# Altium schematic sheet Connector.SchDoc
size A4; SheetNumber: 2; SheetTotal: 2
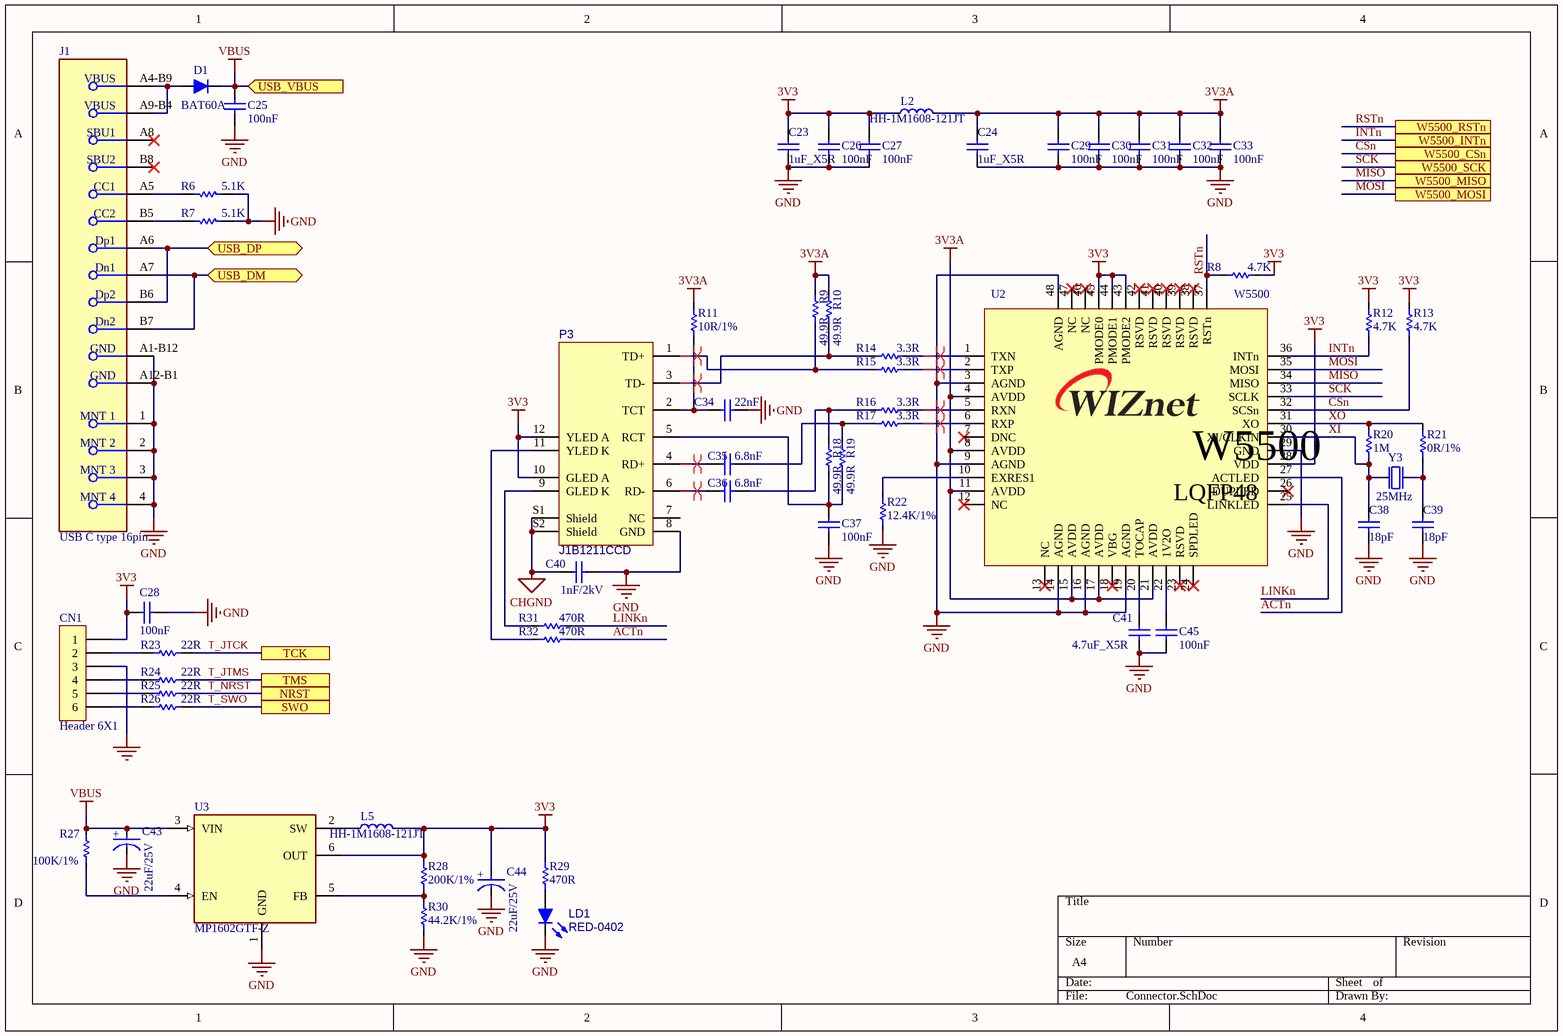
[diagram p0: Connector.SchDoc]

## Parts
C23  1uF_X5R  [CAP-0402]
C24  1uF_X5R  [CAP-0402]
C25  100nF  [0603C]
C26  100nF  [0603C]
C27  100nF  [0603C]
C28  100nF  [0603C]
C29  100nF  [0603C]
C30  100nF  [0603C]
C31  100nF  [0603C]
C32  100nF  [0603C]
C33  100nF  [0603C]
C34  22nF  [CAP-0402]
C35  6.8nF  [CAP-0402]
C36  6.8nF  [CAP-0402]
C37  100nF  [0603C]
C38  18pF  [CAP-0402]
C39  18pF  [CAP-0402]
C40  1nF/2kV  [CAP-1808]
C41  4.7uF_X5R  [0603C]
C43  22uF/25V  [CAP-A Size-(2+)]
C44  22uF/25V  [CAP-A Size-(2+)]
C45  100nF  [0603C]
CN1  Header 6X1  [HDR_1x6_2R54_V_M]
D1  BAT60A  [SOD-323(1-C,2-A)]
J1  USB C type 16pin  [FP-216990-0001-MFG]
L2  HH-1M1608-121JT  [IND-0603]
L5  HH-1M1608-121JT  [IND-0603]
LD1  RED-0402  [LED-0603-RED]
P3  J1B1211CCD  [RJ45-J1B1211CCD]
R6  5.1K  [0603R]
R7  5.1K  [0603R]
R8  4.7K  [RES-0402]
R9  49.9R  [RES-0402]
R10  49.9R  [RES-0402]
R11  10R/1%  [RES-0402]
R12  4.7K  [RES-0402]
R13  4.7K  [RES-0402]
R14  3.3R  [RES-0402]
R15  3.3R  [RES-0402]
R16  3.3R  [RES-0402]
R17  3.3R  [RES-0402]
R18  49.9R  [RES-0402]
R19  49.9R  [RES-0402]
R20  1M  [RES-0402]
R21  0R/1%  [RES-0402]
R22  12.4K/1%  [RES-0402]
R23  22R  [0603R]
R24  22R  [0603R]
R25  22R  [0603R]
R26  22R  [0603R]
R27  100K/1%  [RES-0402]
R28  200K/1%  [RES-0402]
R29  470R  [RES-0402]
R30  44.2K/1%  [RES-0402]
R31  470R  [RES-0402]
R32  470R  [RES-0402]
U2  W5500  [W5500-LQFP48]
U3  MP1602GTF-Z  [SOT-563]
Y3  25MHz  [OSC-82J0626]

## Ports
NRST, SWO, TCK, TMS, USB_DM (bidir), USB_DP (bidir), USB_VBUS (in), W5500_CSn, W5500_INTn, W5500_MISO, W5500_MOSI, W5500_RSTn, W5500_SCK

## Nets
3V3: C23.2 C26.1 C27.1 C28.1 C44.2(A) CN1.1 L2.1 L5.2 P3.10(GLED_A) P3.12(YLED_A) R8.2 R12.1 R13.1 R28.2 R29.2 U2.28(VDD) U2.43(PMODE2) U2.44(PMODE1) U2.45(PMODE0) U3.6(OUT)
3V3A: C24.2 C29.1 C30.1 C31.1 C32.1 C33.1 L2.2 R9.2 R10.2 R11.1 U2.4(AVDD) U2.8(AVDD) U2.11(AVDD) U2.15(AVDD) U2.17(AVDD) U2.21(AVDD)
CHGND: C40.2 P3.S1(Shield) P3.S2(Shield)
GND: C23.1 C24.1 C25.2 C26.2 C27.2 C28.2 C29.2 C30.2 C31.2 C32.2 C33.2 C34.1 C37.2 C38.1 C39.1 C40.1 C41.2 C43.1(C) C44.1(C) C45.2 CN1.3 J1.1(MNT_1) J1.2(MNT_2) J1.3(MNT_3) J1.4(MNT_4) J1.A1-B12(GND) J1.A12-B1(GND) LD1.2(K) P3.8(GND) R6.1 R7.1 R22.2 R30.1 U2.3(AGND) U2.9(AGND) U2.14(AGND) U2.16(AGND) U2.19(AGND) U2.29(GND) U2.48(AGND) U3.1(GND) Y3.2(GND) Y3.4(GND)
VBUS: C25.1 C43.2(A) D1.1(K) R27.1 U3.3(VIN) ; port USB_VBUS
ACTn: R32.2 U2.27(ACTLED)
CSn: R13.2 U2.32(SCSn) ; port W5500_CSn
INTn: R12.2 U2.36(INTn) ; port W5500_INTn
LINKn: R31.2 U2.25(LINKLED)
MISO: U2.34(MISO) ; port W5500_MISO
MOSI: U2.35(MOSI) ; port W5500_MOSI
RSTn: R8.1 U2.37(RSTn) ; port W5500_RSTn
SCK: U2.33(SCLK) ; port W5500_SCK
T_JTCK: R23.2 ; port TCK
T_JTMS: R24.2 ; port TMS
T_NRST: R25.2 ; port NRST
T_SWO: R26.2 ; port SWO
USB_DM: J1.A7(Dn1) J1.B7(Dn2) ; port USB_DM
USB_DP: J1.A6(Dp1) J1.B6(Dp2) ; port USB_DP
XI: C38.2 R20.1 U2.30(XI/CLKIN) Y3.1(inp)
XO: R20.2 R21.2 U2.31(XO)
NetC34_2: C34.2 P3.2(TCT) R11.2
NetC35_1: C35.1 R17.1 R19.2
NetC35_2: C35.2 P3.4(RD+)
NetC36_1: C36.1 R16.1 R18.2
NetC36_2: C36.2 P3.6(RD-)
NetC37_1: C37.1 P3.5(RCT) R18.1 R19.1
NetC39_2: C39.2 R21.1 Y3.3(out)
NetC41_1: C41.1 U2.20(TOCAP)
NetC45_1: C45.1 U2.22(1V2O)
NetCN1_2: CN1.2 R23.1
NetCN1_4: CN1.4 R24.1
NetCN1_5: CN1.5 R25.1
NetCN1_6: CN1.6 R26.1
NetD1_2: D1.2(A) J1.A4-B9(VBUS) J1.A9-B4(VBUS)
NetJ1_A5: J1.A5(CC1) R6.2
NetJ1_B5: J1.B5(CC2) R7.2
NetL5_1: L5.1 U3.2(SW)
NetLD1_1: LD1.1(A) R29.1
NetP3_1: P3.1(TD+) R9.1 R15.1
NetP3_3: P3.3(TD-) R10.1 R14.1
NetP3_9: P3.9(GLED_K) R31.1
NetP3_11: P3.11(YLED_K) R32.1
NetR14_2: R14.2 U2.1(TXN)
NetR15_2: R15.2 U2.2(TXP)
NetR16_2: R16.2 U2.5(RXN)
NetR17_2: R17.2 U2.6(RXP)
NetR22_1: R22.1 U2.10(EXRES1)
NetR27_2: R27.2 U3.4(EN)
NetR28_1: R28.1 R30.2 U3.5(FB)

Not connected (* = marked no-connect by the designer): J1 A8(SBU1)* B8(SBU2)*; P3 7(NC); U2 7(DNC)* 12(NC)* 13(NC)* 18(VBG)* 23(RSVD)* 24(SPDLED)* 26(DUPLED)* 38(RSVD)* 39(RSVD)* 40(RSVD)* 41(RSVD)* 42(RSVD)* 46(NC)* 47(NC)*

## Layout directives
differential pair: NetC35_2, NetC36_2, NetP3_1, NetP3_3, NetR14_2, NetR15_2, NetR16_2, NetR17_2

## Notes on the sheet
- (in symbol CMP-03017-000014-1) +
- (in symbol W5500) LQFP48

## Library data of the parts
C23 C24 C34-C36 C38 C39 = CAP-0402: Ceramic CAP 0402(1005)
C25-C33 C37 C45 = Cap: 0402; Value: 10nF; Published: 8-Jun-2000; Revision: July-2002: Re-released for DXP Platform.; Publisher: Altium Limited
C40 = CAP-1808: Ceramic CAP 1808(4520)
C41 = CAP SMD 0603  X5R 1킚 25V 10%: 0402  X5R 4.7uF; Value: 1킚; Rated voltage: 25V; Tolerance: 10%; Manufacturer: *; Manufacturer P/N: *; Order code Farnell: 1288202RL; Power: *; Technology: X5R; Temperature  Factor: *; Temperature Max: +125캜; Temperature Min: -55캜; STS Code: *
C43 C44 = CMP-03017-000014-1: Chip Tantal A size 22uF 25V; Tolerance: 20%; Life (Hours): 2000Hour; Voltage Rating: 6.3V; ESR (Equivalent Series Resistance): 45mR; Capacitance: 100uF; Case Code (Metric): 3216; Features: General Purpose; Max Operating Temperature: 105°C; Case/Package: 1206; Case Code (Imperial): 1206; Min Operating Temperature: -55°C; Mount: Surface Mount; Packaging: Tape and Reel; RoHS Compliant: Yes
CN1 = Header 6X1: Header, 6-Pin, Single row; LatestRevisionDate: 17-Jul-2002; LatestRevisionNote: Re-released for DXP Platform.; Publisher: Altium Limited
D1 = DIODE-BAT60A: Silicon Schottky Diode
J1 = CMP-04767-000014-1
L2 L5 = IND-0603: Inductor 0603(1608)
LD1 = LED-0603: LED-0402
R6 R7 R23-R26 = Resistor_ST: RES-0402; Value: 10K
R8-R22 R27-R32 = RES-0402
U2 = W5500: WIZnet Hardwired TCP/IP Chip
U3 = CMP-04918-000669-1: monolithic, step-down, switchmode converter with built-in internal power MOSFETs. It achieves 2A continuous output current from a 2.5V-to-5.5V input voltage with excellent load and line regulation. The output voltage can be regulated to as low as 0.6V.; RoHS Compliant: Yes
Y3 = OSC-82J0626-25MHz: X-tal 25MHz,3.2x2.5 SMD, CL=18pF